# Altium project fastic_readout.PrjPcb (part 3 of 3)

## Sheet usb.SchDoc: FastIC+ readout
size 420 x 297 mm; CheckedBy: Jerome A. Alozy; DrawnBy: Vojtech Vosahlo; Organization: CERN; Revision: 2.0; SheetNumber: 3; SheetTotal: 6; CreateDate: 11/1/2024; ModifiedDate: -
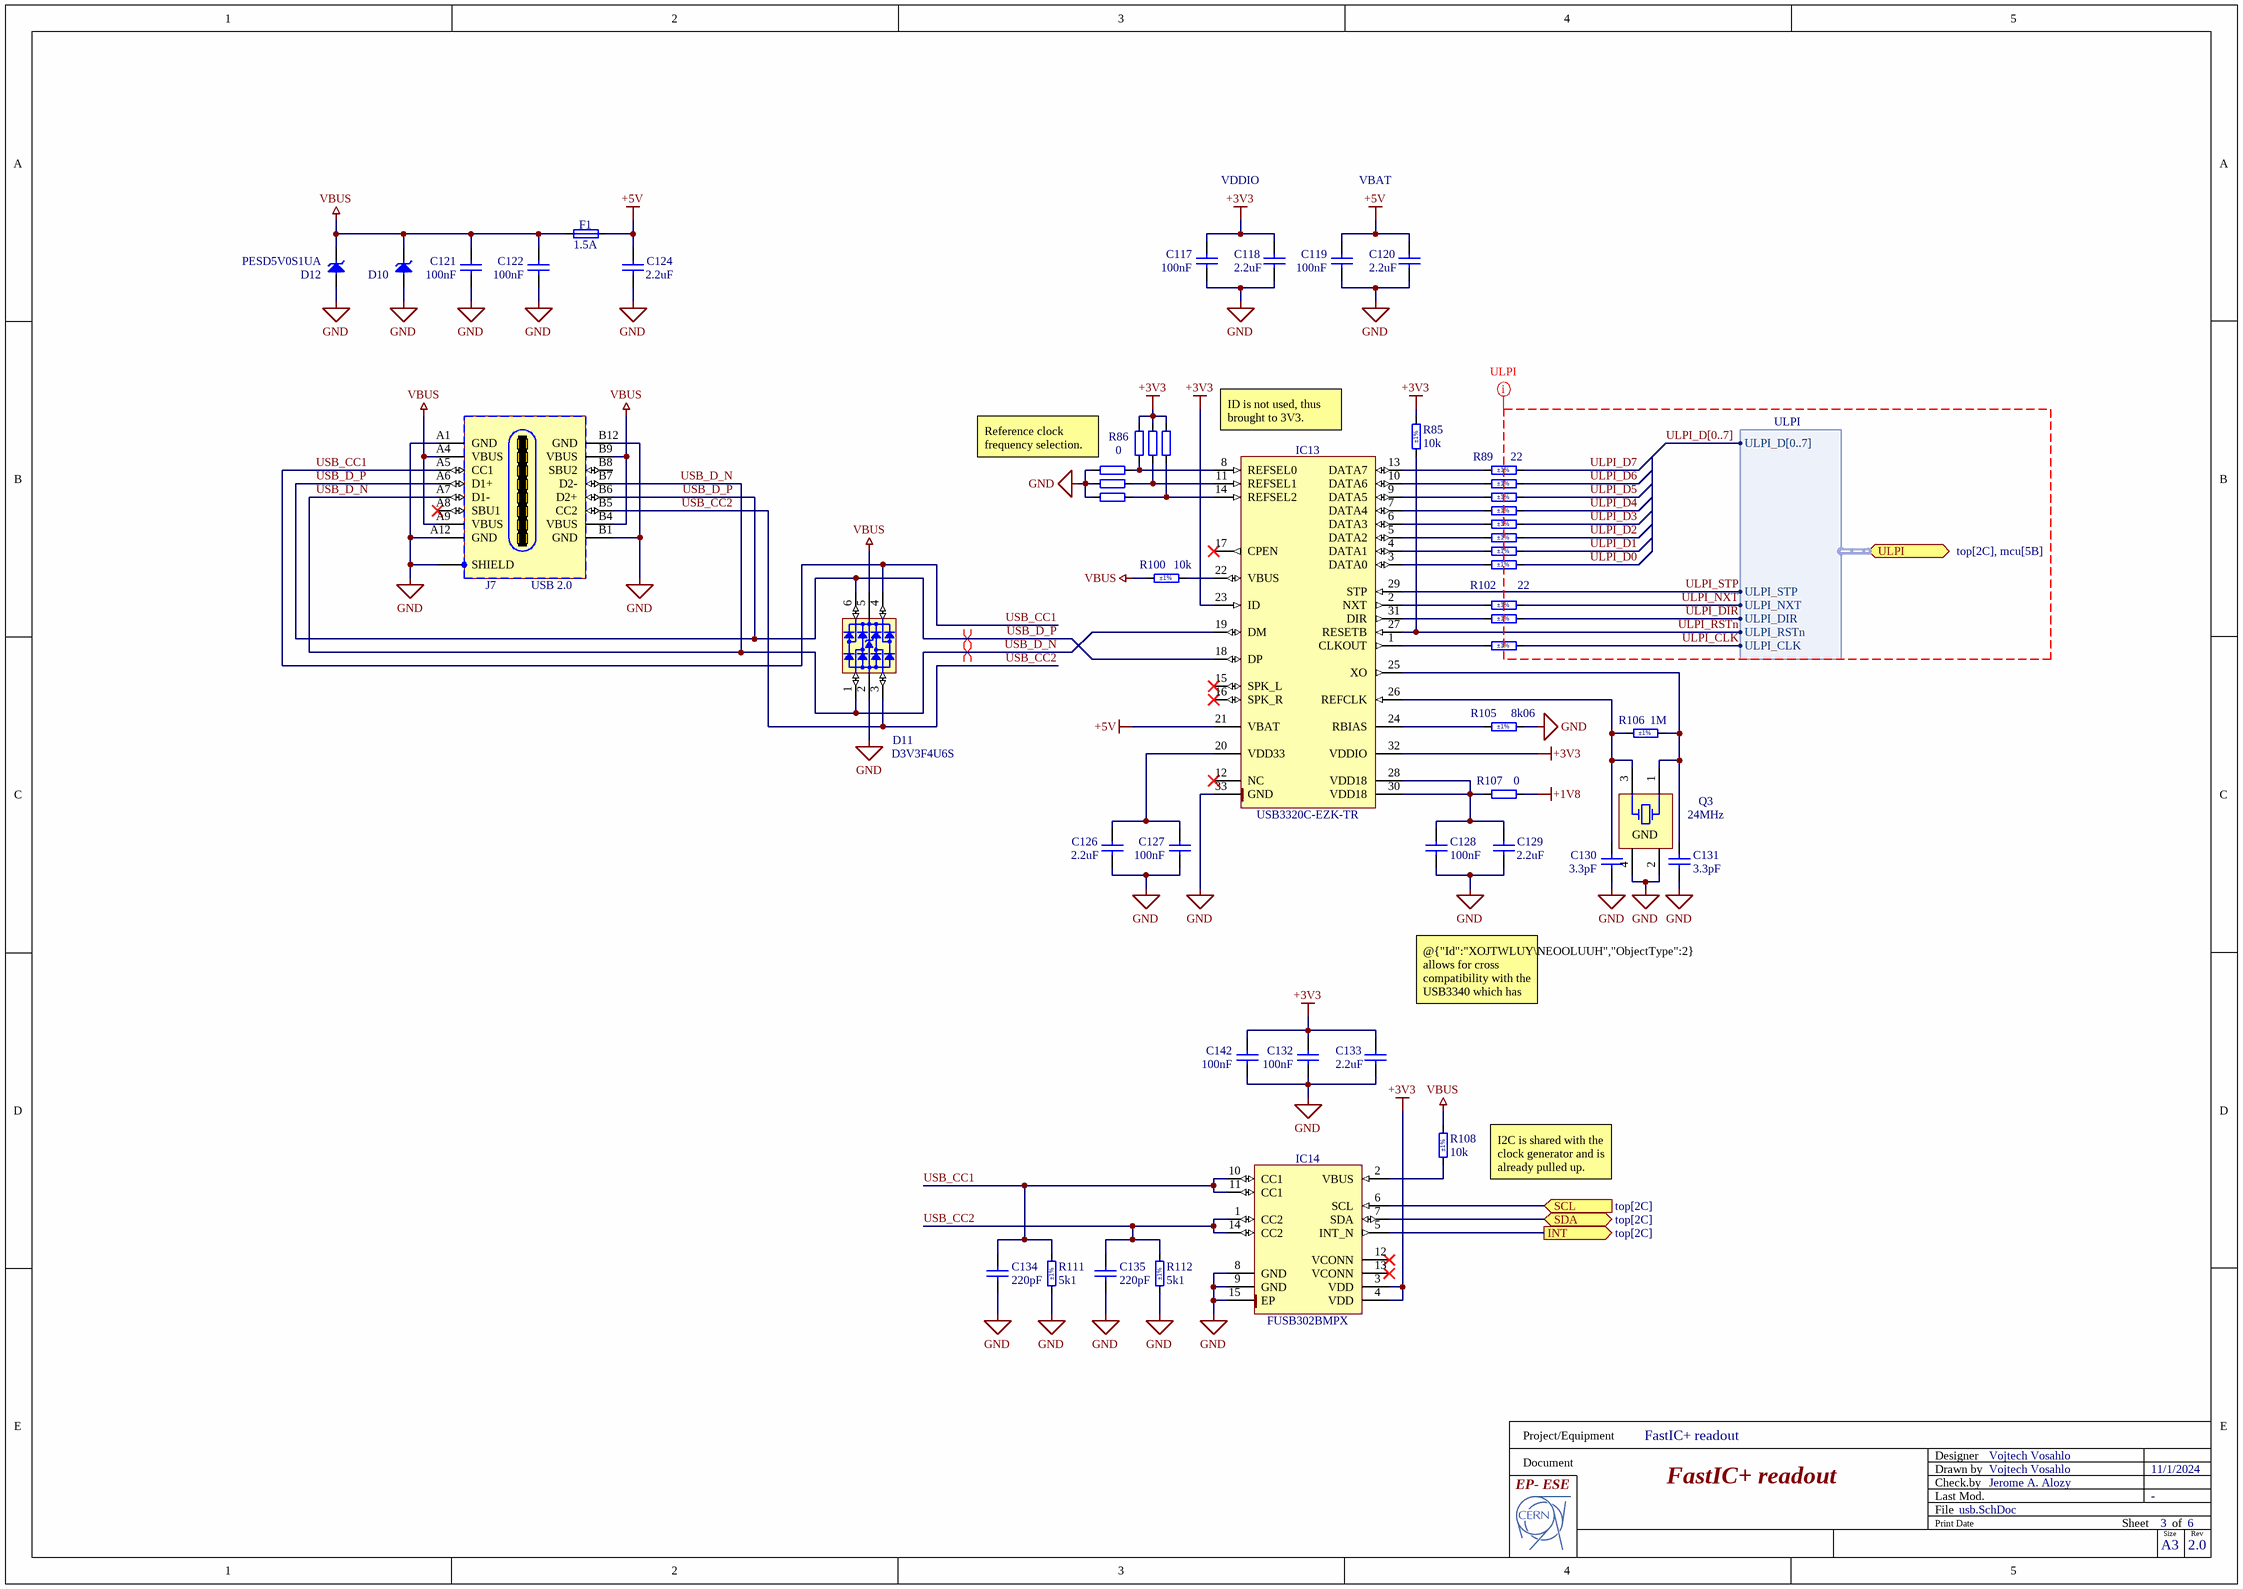
[diagram p6: usb.SchDoc]

### Parts
(Parts that share a designator on the sheet are numbered #1, #2 ... from top to bottom, then left to right.)
C117  100nF  [CAPC1005X55N]
C118  2.2uF  [CAPC1608X90N]
C119  100nF  [CAPC1005X55N]
C120#2  2.2uF  [CAPC1608X90N]
C121  100nF  [CAPC1005X55N]
C122#2  100nF  [CAPC1005X55N]
C124#2  2.2uF  [CAPC1608X90N]
C126#2  2.2uF  [CAPC1608X90N]
C127#2  100nF  [CAPC1005X55N]
C128#2  100nF  [CAPC1005X55N]
C129#2  2.2uF  [CAPC1608X90N]
C130#2  3.3pF  [CAPC1005X55N]
C131  3.3pF  [CAPC1005X55N]
C132#2  100nF  [CAPC1005X55N]
C133  2.2uF  [CAPC1608X90N]
C134  220pF  [CAPC1005X55N]
C135  220pF  [CAPC1005X55N]
C142#2  100nF  [CAPC1005X55N]
D10  PESD5V0S1UA  [SOD2512X110N]  (value not drawn)
D11  D3V3F4U6S  [SOT65P220X110-6N]
D12  PESD5V0S1UA  [SOD2512X110N]
F1  1.5A  [FUSC_BOURNS_SF-0603F]
IC13#2  USB3320C-EZK-TR  [QFN50P500X500X100-33N-S340]
IC14  FUSB302BMPX  [QFN50P250X250X80-15N-S145]
J7  USB 2.0  [GCT_USB4105-GF-A]
Q3  24MHz  [XTAL_EPSON_TSX-3225]
R85  10k  Tolerance: ±1%  [RESC1005X40N]
R86  0  [RESC1005X40N]
R87  0  [RESC1005X40N]  (value not drawn)
R88  0  [RESC1005X40N]  (value not drawn)
R89  22  Tolerance: ±1%  [RESC1005X40N]
R90  Tolerance: ±1%  [RESC1005X40N]  (hidden comment: 22)
R91  0  [RESC1005X40N]  (value not drawn)
R92  Tolerance: ±1%  [RESC1005X40N]  (hidden comment: 22)
R93  0  [RESC1005X40N]  (value not drawn)
R94  Tolerance: ±1%  [RESC1005X40N]  (hidden comment: 22)
R95  0  [RESC1005X40N]  (value not drawn)
R96  Tolerance: ±1%  [RESC1005X40N]  (hidden comment: 22)
R97  Tolerance: ±1%  [RESC1005X40N]  (hidden comment: 22)
R98  Tolerance: ±1%  [RESC1005X40N]  (hidden comment: 22)
R99  Tolerance: ±1%  [RESC1005X40N]  (hidden comment: 22)
R100  10k  Tolerance: ±1%  [RESC1005X40N]
R102  22  Tolerance: ±1%  [RESC1005X40N]
R103  Tolerance: ±1%  [RESC1005X40N]  (hidden comment: 22)
R104  Tolerance: ±1%  [RESC1005X40N]  (hidden comment: 22)
R105  8k06  Tolerance: ±1%  [RESC1005X40N]
R106  1M  Tolerance: ±1%  [RESC1005X40N]
R107  0  [RESC1005X40N]
R108  10k  Tolerance: ±1%  [RESC1005X40N]
R111  5k1  Tolerance: ±1%  [RESC1005X40N]
R112  5k1  Tolerance: ±1%  [RESC1005X40N]

### Ports
INT (out, see top[2C]), SCL (in, see top[2C]), SDA (bidir, see top[2C]), ULPI (bidir, harness ULPI, see top[2C], mcu[5B])

### Harnesses
ULPI: ULPI_D[0..7], ULPI_STP, ULPI_NXT, ULPI_DIR, ULPI_RSTn, ULPI_CLK

### Nets
+1V8: R107.2
+3V3: C117.2 C118.1 C132#2.2 C133.1 C142#2.2 IC13#2.23(ID) IC13#2.32(VDDIO) IC14.3(VDD) IC14.4(VDD) R85.2 R86.2 R87.2 R88.2
+5V: C119.2 C120#2.1 C124#2.2 F1.2 IC13#2.21(VBAT)
GND: C117.1 C118.2 C119.1 C120#2.2 C121.1 C122#2.1 C124#2.1 C126#2.1 C127#2.1 C128#2.1 C129#2.1 C130#2.1 C131.1 C132#2.1 C133.2 C134.1 C135.1 C142#2.1 D10.2(A) D11.2(GND) D12.2(A) IC13#2.33(GND) IC14.8(GND) IC14.9(GND) IC14.15(EP) J7.A1(GND) J7.A12(GND) J7.B1(GND) J7.B12(GND) J7.SHIELD Q3.2(GND) Q3.4(GND) R91.2 R93.2 R95.2 R105.2 R111.1 R112.1
VBUS: C121.2 C122#2.2 D10.1(C) D11.5(VBUS) D12.1(C) F1.1 J7.A4(VBUS) J7.A9(VBUS) J7.B4(VBUS) J7.B9(VBUS) R100.1 R108.2
ULPI_CLK: R104.2 ; port ULPI.ULPI_CLK
ULPI_D0: R99.2
ULPI_D1: R98.2
ULPI_D2: R97.2
ULPI_D3: R96.2
ULPI_D4: R94.2
ULPI_D5: R92.2
ULPI_D6: R90.2
ULPI_D7: R89.2
ULPI_DIR: R103.2 ; port ULPI.ULPI_DIR
ULPI_NXT: R102.2 ; port ULPI.ULPI_NXT
ULPI_RSTn: IC13#2.27(RESETB) R85.1 ; port ULPI.ULPI_RSTn
ULPI_STP: IC13#2.29(STP) ; port ULPI.ULPI_STP
USB_CC1: C134.2 D11.4(I/O3) IC14.10(CC1) IC14.11(CC1) J7.A5(CC1) R111.2
USB_CC2: C135.2 D11.3(I/O2) IC14.1(CC2) IC14.14(CC2) J7.B5(CC2) R112.2
USB_D_N: D11.1(I/O1) IC13#2.19(DM) J7.A7(D1-) J7.B7(D2-)
USB_D_P: D11.6(I/O4) IC13#2.18(DP) J7.A6(D1+) J7.B6(D2+)
NetC126#2_2: C126#2.2 C127#2.2 IC13#2.20(VDD33)
NetC128#2_2: C128#2.2 C129#2.2 IC13#2.28(VDD18) IC13#2.30(VDD18) R107.1
NetC130#2_2: C130#2.2 IC13#2.26(REFCLK) Q3.3(X) R106.1
NetC131_2: C131.2 IC13#2.25(XO) Q3.1(X) R106.2
NetIC13#2_1: IC13#2.1(CLKOUT) R104.1
NetIC13#2_2: IC13#2.2(NXT) R102.1
NetIC13#2_3: IC13#2.3(DATA0) R99.1
NetIC13#2_4: IC13#2.4(DATA1) R98.1
NetIC13#2_5: IC13#2.5(DATA2) R97.1
NetIC13#2_6: IC13#2.6(DATA3) R96.1
NetIC13#2_7: IC13#2.7(DATA4) R94.1
NetIC13#2_8: IC13#2.8(REFSEL0) R86.1 R91.1
NetIC13#2_9: IC13#2.9(DATA5) R92.1
NetIC13#2_10: IC13#2.10(DATA6) R90.1
NetIC13#2_11: IC13#2.11(REFSEL1) R87.1 R93.1
NetIC13#2_13: IC13#2.13(DATA7) R89.1
NetIC13#2_14: IC13#2.14(REFSEL2) R88.1 R95.1
NetIC13#2_22: IC13#2.22(VBUS) R100.2
NetIC13#2_24: IC13#2.24(RBIAS) R105.1
NetIC13#2_31: IC13#2.31(DIR) R103.1
NetIC14_2: IC14.2(VBUS) R108.1
NetIC14_5: IC14.5(INT_N) ; port INT
NetIC14_6: IC14.6(SCL) ; port SCL
NetIC14_7: IC14.7(SDA) ; port SDA

Not connected (* = marked no-connect by the designer): IC13#2 12(NC)* 15(SPK_L)* 16(SPK_R)* 17(CPEN)*; IC14 12(VCONN)* 13(VCONN)*; J7 A8(SBU1)* B8(SBU2)

### Buses and harness runs
bus ULPI_D[0..7]

### Layout directives
differential pair: USB_D_N, USB_D_P
net class ULPI: ULPI_CLK, ULPI_D0, ULPI_D1, ULPI_D2, ULPI_D3, ULPI_D4, ULPI_D5, ULPI_D6, ULPI_D7, ULPI_D[0..7], ULPI_DIR, ULPI_NXT, ULPI_RSTn, ULPI_STP

### Notes on the sheet
- VDDIO
- VBAT
- (near R91) Reference clock frequency selection.
- ID is not used, thus brought to 3V3.
- @{"Id":"XOJTWLUY\NEOOLUUH","ObjectType":2}  allows for cross compatibility with the USB3340 which has internal 1V8 LDO.
- (near R108) I2C is shared with the clock generator and is already pulled up.
- Project/Equipment
- Document
- Designer
- Drawn by
- Check.by
- File
- Last Mod.
- Print Date
- Sheet
- Size
- A3
- of
- Rev

### Library data of the parts
C117 C119 C121 C122#2 C127#2 C128#2 C132#2 C142#2 = CC0402_100NF_16V_10%_X7R: Non-polarised capacitor; Part Description: SMD Multilayer Chip Ceramic Capacitor; Manufacturer: GENERIC; Manufacturer1 Part Number: GRM155R71C104KA88D; Voltage: 16V; TC: X7R; Tolerance: ±10%; Part Number: CC0402_100NF_16V_10%_X7R; Component Kind: Standard; Component Type: Standard; Pin Count: 2; Value: 100nF; Status: Not Recommended; Manufacturer Part Number: CC0402_100NF_16V_10%_X7R; Case: 0402; Mounted: Yes; Socket: No; SMD: Yes; Sense: No; Manufacturer1 Example: MURATA; Manufacturer1 ComponentHeight: 0.55mm; HelpURL: \\cern.ch\dfs\Applications\Altium\Datasheets\CC0402_X7R_MURATA_GRM.pdf; Author: CERN DEM JLC; CreateDate: 12/5/2013; LatestRevisionDate: 12/3/2007
C118 C120#2 C124#2 C126#2 C129#2 C133 = CC0603_2.2UF_10V_20%_X7R: Non-polarised capacitor; Part Description: SMD Multilayer Chip Ceramic Capacitor; Manufacturer: GENERIC; Manufacturer1 Part Number: LMK107B7225MA-T; Voltage: 10V; TC: X7R; Tolerance: ±20%; Part Number: CC0603_2.2UF_10V_20%_X7R; Component Kind: Standard; Component Type: Standard; Pin Count: 2; Value: 2.2uF; Status: Not Recommended; Manufacturer Part Number: CC0603_2.2UF_10V_20%_X7R; Case: 0603; Mounted: Yes; Socket: No; SMD: Yes; Sense: No; Manufacturer1 Example: TAIYO YUDEN; Manufacturer1 ComponentHeight: 0.9mm; HelpURL: \\cern.ch\dfs\Applications\Altium\Datasheets\CC0603_X7R_TAIYO-YUDEN_HIGH-VALUE.pdf; Author: CERN DEM JLC; CreateDate: 6/22/2011; LatestRevisionDate: 6/27/2011
C130#2 C131 = CC0402_3.3PF_50V_0.25PF_C0G: Non-polarised capacitor; Part Description: SMD Multilayer Chip Ceramic Capacitor; Manufacturer: GENERIC; Manufacturer1 Part Number: C0402C339C5GACTU; Voltage: 50V; TC: C0G/NP0; Tolerance: ±0.25pF; Part Number: CC0402_3.3PF_50V_0.25PF_C0G; Component Kind: Standard; Component Type: Standard; Pin Count: 2; Value: 3.3pF; Status: Preferred; Manufacturer Part Number: CC0402_3.3PF_50V_0.25PF_C0G; Case: 0402; Mounted: Yes; Socket: No; SMD: Yes; Sense: No; Manufacturer1 Example: KEMET; Manufacturer1 ComponentHeight: 0.55mm; HelpURL: \\cern.ch\dfs\Applications\Altium\Datasheets\CC0402_C0G_KEMET_(Commercial Grade).pdf; Author: CERN DEM JLC; CreateDate: 12/3/2007; LatestRevisionDate: 4/22/2015
C134 C135 = CC0402_220PF_50V_5%_C0G: Non-polarised capacitor; Part Description: SMD Multilayer Chip Ceramic Capacitor; Manufacturer: GENERIC; Manufacturer1 Part Number: C0402C221J5GACTU; Voltage: 50V; TC: C0G/NP0; Tolerance: ±5%; Part Number: CC0402_220PF_50V_5%_C0G; Component Kind: Standard; Component Type: Standard; Pin Count: 2; Value: 220pF; Status: Preferred; Manufacturer Part Number: CC0402_220PF_50V_5%_C0G; Case: 0402; Mounted: Yes; Socket: No; SMD: Yes; Sense: No; Manufacturer1 Example: KEMET; Manufacturer1 ComponentHeight: 0.55mm; HelpURL: \\cern.ch\dfs\Applications\Altium\Datasheets\CC0402_C0G_KEMET_(Commercial Grade).pdf; Author: CERN DEM JLC; CreateDate: 12/3/2007; LatestRevisionDate: 4/22/2015
D10 D12 = PESD5V0S1UA: Transient Voltage Suppressor Diode (Uni-Directional); Part Description: Unidirectional ESD Protection for Transient Voltage Suppression; Manufacturer: NXP SEMICONDUCTORS; Voltage: 5V; Power: 890W; PressFit: No; Bonding: No; Part Number: PESD5V0S1UA; Component Kind: Standard; Component Type: Standard; Device: PESD5V0S1UA; PackageDescription: Small Outline Diode (SOD-323), 1.70mm W X 1.25mm L X 1.10mm H body,  IPC Medium Density; Manufacturer Part Number: PESD5V0S1UA; Pin Count: 2; Case: SOD323; Mounted: Yes; Socket: No; SMD: Yes; Sense: No; ComponentHeight: 1.1mm; HelpURL: \\cern.ch\dfs\Applications\Altium\Datasheets\PESD5V0S1UA.pdf; Author: CERN DEM JLC; CreateDate: 8/28/2012; LatestRevisionDate: 9/18/2013
D11 = D3V3F4U6S: Integrated Quad Ultra-Low Capacitance ESD Protection; Part Description: 0.85pF 4 Channel Low Capacitance TVS Diode Array ESD; Manufacturer: DIODES INCORPORATED; PressFit: No; Bonding: No; Voltage: 8kV; Part Number: D3V3F4U6S; Component Kind: Standard; Component Type: Standard; Device: D3V3F4U6S; PackageDescription: SOT363, SC70-6, 0.65mm Pitch; 6 pin, 1.25mm W X 2.00mm L X 1.10mm H body, IPC Medium Density; Manufacturer Part Number: D3V3F4U6S; Pin Count: 6; Case: SOT363; Mounted: Yes; Socket: No; SMD: Yes; Sense: No; ComponentHeight: 2.1mm; HelpURL: \\cern.ch\dfs\Applications\Altium\Datasheets\D3V3F4U6S.pdf; Author: CERN DEM HF; CreateDate: 11/28/2022; LatestRevisionDate: 11/28/2022
F1 = FUS0603_BOURNS-SF-0603F050-2: Fuse; Part Description: Fast Acting Thin Film Chip Fuse for Overcurrent Protection, SinglFuse™ SF-0603F  Series; Manufacturer: BOURNS; PressFit: No; Part Number: FUS0603_BOURNS-SF-0603F050-2; Component Kind: Standard; Component Type: Standard; Pin Count: 2; Case: 0603; PackageDescription: Chip Fuse, 2-Leads, Body 1.6mm x 0.8mm, IPC Medium Density; Family: Fuse; Mounted: Yes; Socket: No; SMD: Yes; Sense: No; Value: 1.5A; Manufacturer Part Number: SF-0603F050-2; ComponentHeight: 0.55mm; HelpURL: \\cern.ch\dfs\Applications\Altium\Datasheets\FUSC_BOURNS_SF-0603F.pdf; Author: CERN DEM JLC; CreateDate: 2/1/2017; LatestRevisionDate: 2/1/2017
IC13#2 = USB3320C-EZK-TR: Highly Integrated, Full Featured Hi-Speed USB 2.0 ULPI Transceiver; Manufacturer: MICROCHIP TECHNOLOGY; PressFit: No; Bonding: No; Part Number: USB3320C-EZK-TR; Component Kind: Standard; Component Type: Standard; Device: USB3320C-EZK-TR; PackageDescription: QFN, (MO-220-VHHD-2) 0.50mm Pitch, Square; 32 Pin, 5.00mm L X 5.00mm W X 1.00mm H body (w/Thermal Tab 3.40 X 3.40mm), IPC Medium Density; Part Description: Highly Integrated, Full Featured Hi-Speed USB 2.0 ULPI Transceiver; Manufacturer Part Number: USB3320C-EZK; Pin Count: 33; Case: QFN32; Mounted: Yes; Socket: No; SMD: Yes; Sense: No; ComponentHeight: 1mm; Author: CERN DEM JLC; HelpURL: \\cern.ch\dfs\Applications\Altium\Datasheets\USB3320C-EZK-TR.pdf; CreateDate: 7/22/2014; LatestRevisionDate: 6/2/2022
IC14 = FUSB302BMPX: Programmable USB Type-C Controller with PD (Default SNK); Manufacturer: ON SEMICONDUCTOR; PressFit: No; Bonding: No; Part Number: FUSB302BMPX; Component Kind: Standard; Component Type: Standard; Device: FUSB302BMPX; PackageDescription: QFN, 0.50mm Pitch, Rect.; 4 Pin X 3 Pin, 2.50mm L X 2.50mm W X 0.80mm H body (w/Thermal Tab 1.45 X 1.45mm), IPC Medium Density; Part Description: Programmable USB Type-C Controller with PD (Default SNK); Manufacturer Part Number: FUSB302BMPX; Pin Count: 15; Case: QFN14; Mounted: Yes; Socket: No; SMD: Yes; Sense: No; ComponentHeight: 0.8mm; Author: CERN DEM JMW; HelpURL: \\cern.ch\dfs\Applications\Altium\Datasheets\FUSB302BMPX.pdf; CreateDate: 12/3/2019; LatestRevisionDate: 12/3/2019
J7 = GCT_USB4105-GF-A: 2x8 Pin + 1 Shield  USB Type C Receptacle; Part Description: USB 2.0 Type C Receptacle 16 Contacts, SMD, horizontal; Manufacturer: GCT; PressFit: No; Part Number: GCT_USB4105-GF-A; Component Kind: Standard; Component Type: Standard; Pin Count: 20; Family: USB 2.0; Mounted: Yes; Socket: No; SMD: Yes; Sense: No; Status: None; Manufacturer Part Number: USB4105-GF-A; ComponentHeight: 3.31mm; HelpURL: \\cern.ch\dfs\Applications\Altium\Datasheets\GCT_USB4105-GF-A.pdf; Author: CERN DEM HF; CreateDate: 10/12/2023; LatestRevisionDate: 10/12/2023
Q3 = XTAL_24MHZ_EPSON_TSX-3225 24.0000MF15X-AC: Crystal 4 pins 1=XTAL Control 2=GND3=XTAL 4=GND; Part Description: Tolerance: ±10ppm, Stability: ±15ppm, -40°C to +85°C, 9pF, Surface Mount Quartz Crystal, TX-3225 Series; Manufacturer: EPSON; PressFit: No; Bonding: No; Part Number: XTAL_24MHZ_EPSON_TSX-3225 24.0000MF15X-AC; Component Kind: Standard; Component Type: Standard; PackageDescription: Crystal, Corner Concave; 4 Pin, 2.50mm L X 3.20mm W X 0.60mm H, TSX-3225 Serie; Value: 24MHz; Manufacturer Part Number: TSX-3225 24.0000MF15X-AC; Pin Count: 4; Mounted: Yes; Socket: No; SMD: Yes; Sense: No; ComponentHeight: 0.6mm; HelpURL: \\cern.ch\dfs\Applications\Altium\Datasheets\XTAL_EPSON_TSX-3225.pdf; ComponentLink1URL: \\cern.ch\dfs\Applications\Altium\Datasheets\XTAL_EPSON_TSX-3225_Ordering-Informations.pdf; ComponentLink1Description: Ordering Informations; Author: CERN DEM JLC; CreateDate: 10/6/2016; LatestRevisionDate: 10/6/2016
R85 R100 R108 = R0402_10K_1%_0.0625W_100PPM: Resistor - 1%; Part Description: General Purpose Thick Film Chip Resistor; Manufacturer: GENERIC; Manufacturer1 Part Number: 232270671003L; TC: ±100ppm/°C; PressFit: No; Part Number: R0402_10K_1%_0.0625W_100PPM; Component Kind: Standard; Component Type: Standard; Pin Count: 2; Value: 10k; Status: Not Recommended; Power: 0.0625W; Manufacturer Part Number: R0402_10K_1%_0.0625W_100PPM; Case: 0402; Mounted: Yes; Sense: No; Socket: No; SMD: Yes; Manufacturer1 Example: YAGEO PHYCOMP; Manufacturer1 ComponentHeight: 0.4mm; HelpURL: \\cern.ch\dfs\Applications\Altium\Datasheets\R0402_Phycomp_RC0402.pdf; Author: CERN DEM JLC; CreateDate: 12/3/2007; LatestRevisionDate: 10/17/2012
R86-R88 R91 R93 R95 R107 = R0402_0R_JUMPER: Resistor; Part Description: 1A (0.05R Max DC Resistance) Zero Ohm Jumper; Manufacturer: GENERIC; Manufacturer1 Part Number: 232270591001L; PressFit: No; Part Number: R0402_0R_JUMPER; Component Kind: Standard; Component Type: Standard; Pin Count: 2; Value: 0; Status: Not Recommended; Manufacturer Part Number: R0402_0R_JUMPER; Case: 0402; Mounted: Yes; Sense: No; Socket: No; SMD: Yes; Manufacturer1 Example: YAGEO PHYCOMP; Manufacturer1 ComponentHeight: 0.4mm; HelpURL: \\cern.ch\dfs\Applications\Altium\Datasheets\R0402_Phycomp_RC0402.pdf; Author: CERN DEM JLC; CreateDate: 12/3/2007; LatestRevisionDate: 10/17/2012
R89 R90 R92 R94 R96-R99 R102-R104 = R0402_22R_1%_0.0625W_100PPM: Resistor - 1%; Part Description: General Purpose Thick Film Chip Resistor; Manufacturer: GENERIC; Manufacturer1 Part Number: 232270672209L; PressFit: No; TC: ±100ppm/°C; Part Number: R0402_22R_1%_0.0625W_100PPM; Component Kind: Standard; Component Type: Standard; Pin Count: 2; Value: 22; Status: Not Recommended; Manufacturer Part Number: R0402_22R_1%_0.0625W_100PPM; Case: 0402; Mounted: Yes; Sense: No; Socket: No; SMD: Yes; Manufacturer1 Example: YAGEO PHYCOMP; Manufacturer1 ComponentHeight: 0.4mm; HelpURL: \\cern.ch\dfs\Applications\Altium\Datasheets\R0402_Phycomp_RC0402.pdf; Author: CERN DEM JLC; CreateDate: 12/3/2007; LatestRevisionDate: 10/17/2012; Power: 0.0625W
R105 = R0402_8K06_1%_0.0625W_100PPM: Resistor - 1%; Part Description: General Purpose Thick Film Chip Resistor; Manufacturer: GENERIC; Manufacturer1 Part Number: RC0402FR-078K06L; TC: ±100ppm/°C; PressFit: No; Part Number: R0402_8K06_1%_0.0625W_100PPM; Component Kind: Standard; Component Type: Standard; Pin Count: 2; Value: 8k06; Status: Preferred; Power: 0.0625W; Manufacturer Part Number: R0402_8K06_1%_0.0625W_100PPM; Case: 0402; Mounted: Yes; Sense: No; Socket: No; SMD: Yes; Manufacturer1 Example: YAGEO PHYCOMP; Manufacturer1 ComponentHeight: 0.4mm; HelpURL: \\cern.ch\dfs\Applications\Altium\Datasheets\R0402_YAGEO_RC_L.pdf; Author: CERN DEM BC; CreateDate: 3/16/2021; LatestRevisionDate: 3/16/2021
R106 = R0402_1M_1%_0.0625W_100PPM: Resistor - 1%; Part Description: General Purpose Thick Film Chip Resistor; Manufacturer: GENERIC; Manufacturer1 Part Number: 232270671005L; TC: ±100ppm/°C; PressFit: No; Part Number: R0402_1M_1%_0.0625W_100PPM; Component Kind: Standard; Component Type: Standard; Pin Count: 2; Value: 1M; Status: Not Recommended; Power: 0.0625W; Manufacturer Part Number: R0402_1M_1%_0.0625W_100PPM; Case: 0402; Mounted: Yes; Sense: No; Socket: No; SMD: Yes; Manufacturer1 Example: YAGEO PHYCOMP; Manufacturer1 ComponentHeight: 0.4mm; HelpURL: \\cern.ch\dfs\Applications\Altium\Datasheets\R0402_Phycomp_RC0402.pdf; Author: CERN DEM JLC; CreateDate: 12/3/2007; LatestRevisionDate: 10/17/2012
R111 R112 = R0402_5K1_1%_0.0625W_100PPM: Resistor - 1%; Part Description: General Purpose Thick Film Chip Resistor; Manufacturer: GENERIC; Manufacturer1 Part Number: 232270675102L; TC: ±100ppm/°C; PressFit: No; Part Number: R0402_5K1_1%_0.0625W_100PPM; Component Kind: Standard; Component Type: Standard; Pin Count: 2; Value: 5k1; Status: Not Recommended; Power: 0.0625W; Manufacturer Part Number: R0402_5K1_1%_0.0625W_100PPM; Case: 0402; Mounted: Yes; Sense: No; Socket: No; SMD: Yes; Manufacturer1 Example: YAGEO PHYCOMP; Manufacturer1 ComponentHeight: 0.4mm; HelpURL: \\cern.ch\dfs\Applications\Altium\Datasheets\R0402_Phycomp_RC0402.pdf; Author: CERN DEM JLC; CreateDate: 12/3/2007; LatestRevisionDate: 10/17/2012

## Nets that join several sheets
+1V2A: FASTIC1 (18 pins), power (C34#2.2 IC8.1), FASTIC2 (18 pins)
+1V2D: top (D1.2 D3.2 D6.2 D8.2), FASTIC1 (35 pins), power (C30#1.2 IC6.1), FASTIC2 (35 pins)
+1V2T: FASTIC1 (11 pins), power (C32#1.2 IC7.1), FASTIC2 (11 pins)
+1V8: clock (13 pins), power (C26.2 IC4.1), usb (R107.2)
+3V3: top (11 pins), FASTIC1 (9 pins), hv (C145.2 IC30.5), clock (49 pins), power (16 pins), mcu (18 pins), usb (13 pins), FASTIC2 (9 pins)
+3V3A: power (C28.2 IC5.1), mcu (5 pins)
+5V: hv (5 pins), power (5 pins), usb (5 pins)
GND: top (44 pins), FASTIC1 (65 pins), hv (16 pins), clock (41 pins), power (25 pins), mcu (32 pins), usb (38 pins), FASTIC2 (65 pins)
IN0: top (J3.11), FASTIC2 (IC18_FASTIC2.3)
IN0: top (J3.32), FASTIC1 (IC18_FASTIC1.3)
IN1: top (J3.13), FASTIC2 (IC18_FASTIC2.4)
IN1: top (J3.30), FASTIC1 (IC18_FASTIC1.4)
IN2: top (J3.17), FASTIC2 (IC18_FASTIC2.7)
IN2: top (J3.26), FASTIC1 (IC18_FASTIC1.7)
IN3: top (J3.19), FASTIC2 (IC18_FASTIC2.8)
IN3: top (J3.24), FASTIC1 (IC18_FASTIC1.8)
IN4: top (J3.23), FASTIC2 (IC18_FASTIC2.10)
IN4: top (J3.20), FASTIC1 (IC18_FASTIC1.10)
IN5: top (J3.25), FASTIC2 (IC18_FASTIC2.11)
IN5: top (J3.18), FASTIC1 (IC18_FASTIC1.11)
IN6: top (J3.29), FASTIC2 (IC18_FASTIC2.14)
IN6: top (J3.14), FASTIC1 (IC18_FASTIC1.14)
IN7: top (J3.31), FASTIC2 (IC18_FASTIC2.15)
IN7: top (J3.12), FASTIC1 (IC18_FASTIC1.15)
NetD1_3: top (D1.3 D2.2 J1.1 R9#1.2), FASTIC1 (IC18_FASTIC1.76)
NetD6_3: top (D6.3 D7.2 J4.1 R23.2), FASTIC2 (IC18_FASTIC2.76)
NetIC1_FASTIC1_6: top (R17.1), FASTIC1 (IC1_FASTIC1.6)
NetIC1_FASTIC1_7: top (R10.1), FASTIC1 (IC1_FASTIC1.7)
NetIC1_FASTIC2_6: top (R25.1), FASTIC2 (IC1_FASTIC2.6)
NetIC1_FASTIC2_7: top (R24.1), FASTIC2 (IC1_FASTIC2.7)
NetIC4_5: power (IC4.5), mcu (U1.56)
NetIC14_6: mcu (U1.92), usb (IC14.6)
NetIC14_7: mcu (U1.93), usb (IC14.7)
NetIC18_FASTIC1_35: top (R20.1), FASTIC1 (IC18_FASTIC1.35)
NetIC18_FASTIC2_35: top (R26.1), FASTIC2 (IC18_FASTIC2.35)
NetR7_2: top (R7.2), mcu (U1.68)
NetR8_2: top (R8.2), mcu (U1.1)
NetR17_2: top (R17.2), mcu (U1.77)
SLVS2_N: top (R4.2 R5#1.2 R128.2), FASTIC2 (IC18_FASTIC2.39)
SLVS2_P: top (R3.2 R6.2 R128.1), FASTIC2 (IC18_FASTIC2.38)
SLVS3_N: top (R14.2 R15.2 R101.2), FASTIC1 (IC18_FASTIC1.39)
SLVS3_P: top (R13.2 R16.2 R101.1), FASTIC1 (IC18_FASTIC1.38)

## Assembly variants
fastic_readout: not fitted FTG1 FTG2 FTG3 FTG4 FTG5 FTG6 L2 R91 R93 R95 R111 R112